# EAGLE design Combine2Cards (EAGLE 6.6.0)
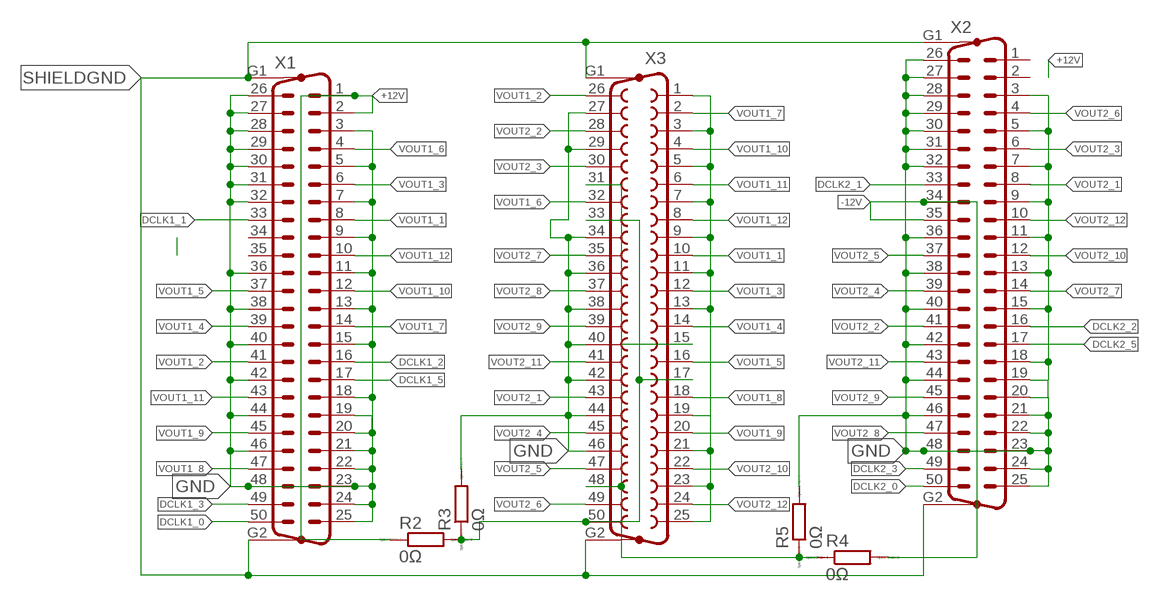
[diagram p0: schematic, sheet 1]

## Parts
R2  0Ω  RR0603  [R0603]
R3  0Ω  RR0603  [R0603]
R4  0Ω  RR0603  [R0603]
R5  0Ω  RR0603  [R0603]
X1  M50VP  [M50VP]
X2  M50VP  [M50VP]
X3  F50VP  [F50VP]

## Nets
+12V: R2.1 X1.1 X1.2
-12V: R4.2 X2.34 X2.35
DCLK1_0: X1.50
DCLK1_1: X1.33
DCLK1_2: X1.16
DCLK1_3: X1.49
DCLK1_5: X1.17
DCLK2_0: X2.50
DCLK2_1: X2.33
DCLK2_2: X2.16
DCLK2_3: X2.49
DCLK2_5: X2.17
GND: R3.2 R5.2 X1.3 X1.5 X1.7 X1.9 X1.11 X1.13 X1.15 X1.18 X1.19 X1.20 X1.21 X1.22 X1.23 X1.24 X1.25 X1.26 X1.27 X1.28 X1.29 X1.30 X1.31 X1.32 X1.36 X1.38 X1.40 X1.42 X1.44 X1.46 X1.48 X2.3 X2.5 X2.7 X2.9 X2.11 X2.13 X2.15 X2.18 X2.19 X2.20 X2.21 X2.22 X2.23 X2.24 X2.25 X2.26 X2.27 X2.28 X2.29 X2.30 X2.31 X2.32 X2.36 X2.38 X2.40 X2.42 X2.44 X2.46 X2.48 X3.1 X3.3 X3.5 X3.7 X3.9 X3.11 X3.13 X3.19 X3.21 X3.23 X3.25 X3.27 X3.29 X3.34 X3.36 X3.38 X3.40 X3.42 X3.44 X3.46
N$1: R2.2 R3.1 X3.17 X3.33 X3.50
N$2: R4.1 R5.1 X3.15 X3.31 X3.48
SHIELDGND: X1.G1 X1.G2 X2.G1 X2.G2 X3.G1 X3.G2
VOUT1_1: X1.8 X3.10
VOUT1_2: X1.41 X3.26
VOUT1_3: X1.6 X3.12
VOUT1_4: X1.39 X3.14
VOUT1_5: X1.37 X3.16
VOUT1_6: X1.4 X3.32
VOUT1_7: X1.14 X3.2
VOUT1_8: X1.47 X3.18
VOUT1_9: X1.45 X3.20
VOUT1_10: X1.12 X3.4
VOUT1_11: X1.43 X3.6
VOUT1_12: X1.10 X3.8
VOUT2_1: X2.8 X3.43
VOUT2_2: X2.41 X3.28
VOUT2_3: X2.6 X3.30
VOUT2_4: X2.39 X3.45
VOUT2_5: X2.37 X3.47
VOUT2_6: X2.4 X3.49
VOUT2_7: X2.14 X3.35
VOUT2_8: X2.47 X3.37
VOUT2_9: X2.45 X3.39
VOUT2_10: X2.12 X3.22
VOUT2_11: X2.43 X3.41
VOUT2_12: X2.10 X3.24
Unconnected: X1.34 X1.35 X2.1 X2.2

## Library data of the parts
R2-R5 = eagle-ltspice:R: RESISTOR, European symbol; SPICEMODEL: NONE; SPICEPREFIX: R
X1 X2 = con-subd:M50VP: SUB-D; OC_FARNELL: unknown; OC_NEWARK: unknown
X3 = con-subd:F50VP: SUB-D; OC_FARNELL: unknown; OC_NEWARK: unknown

## Board
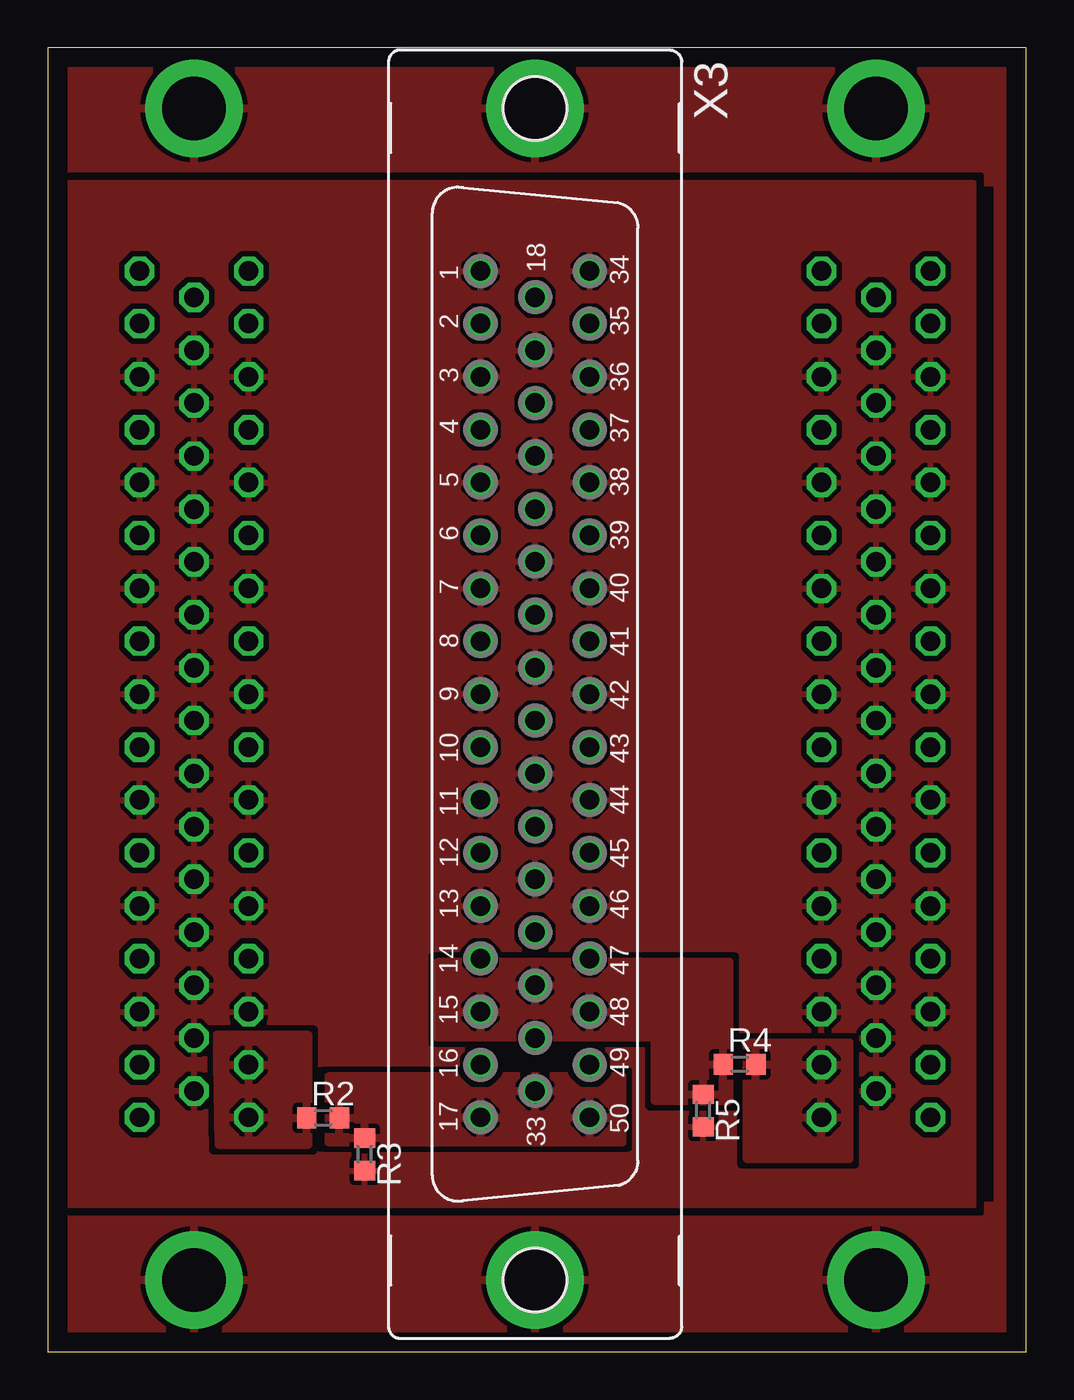
[diagram p1: board, top side]
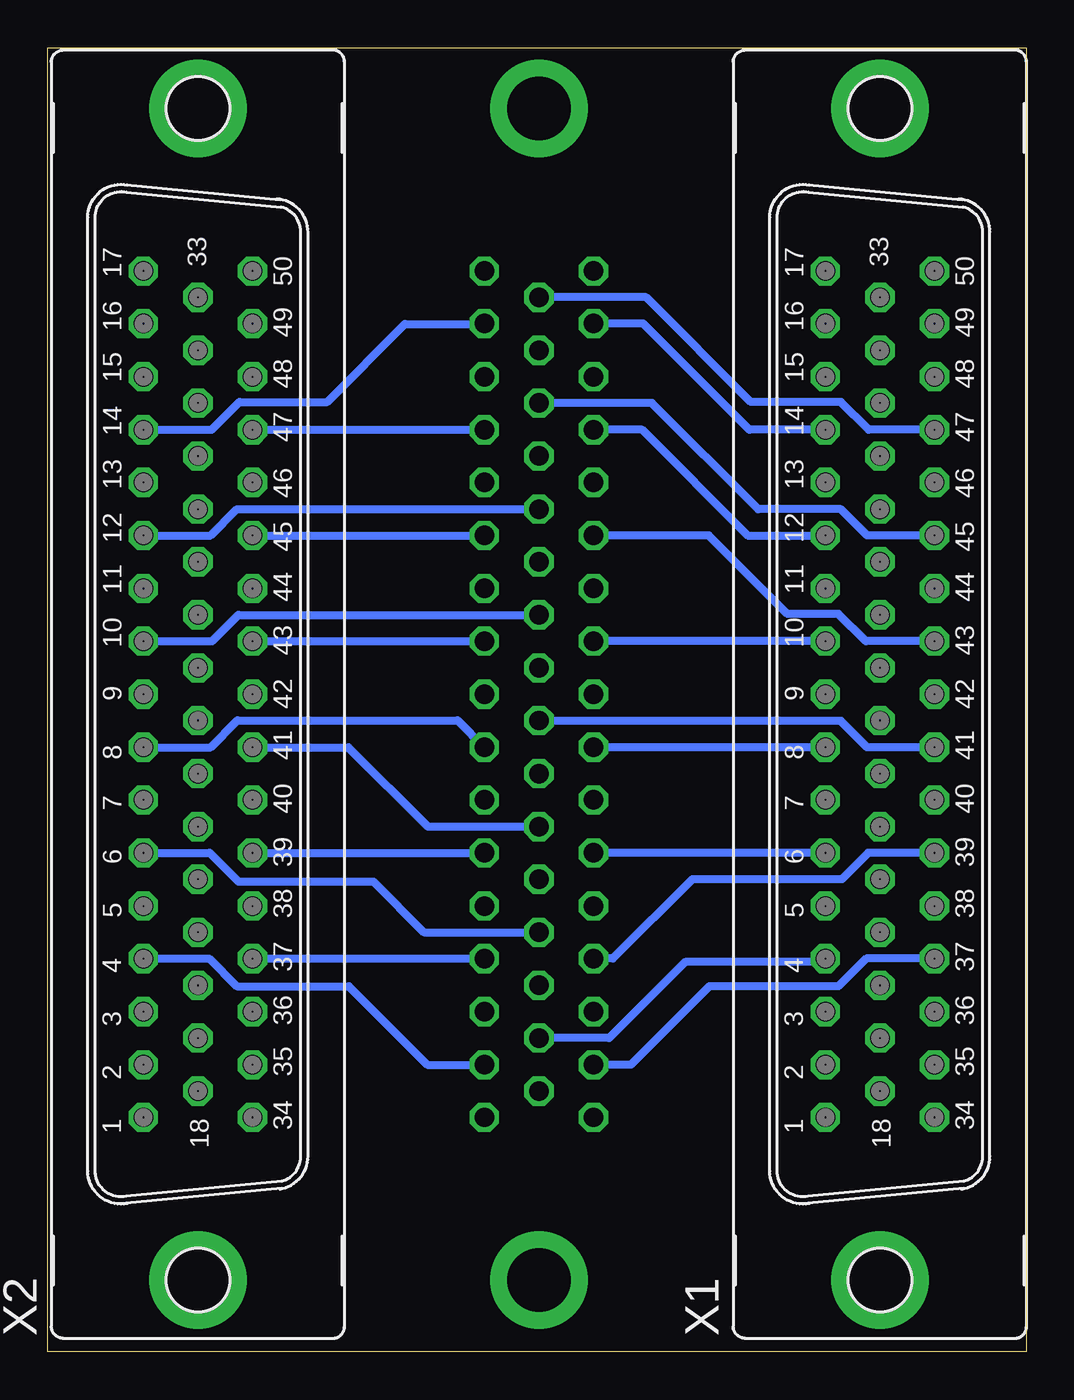
[diagram p2: board, bottom side, seen from below]

Size 51 x 68 mm. Coordinates in mm from the lower left corner, seen from the top.
Outline: 0,0 51,0 51,68 0,68 0,0
Copper layers (1*16): Top 0.035mm / dielectric 1.5mm / Bottom 0.035mm
Design rules "default": minimum track width 10mil, minimum drill 24mil, track to track 8mil, track to pad 8mil, pad to pad 8mil, via to via 8mil, smd to smd 8mil, copper to edge 40mil, drill to drill 8mil, minimum pad ring 10mil, minimum via ring 8mil, stop-mask expansion 4mil, vias tented up to drill 0mil, thermal gap 10mil

### Footprints (pad centres in the part's own frame; a part is rotated, then mirrored left to right if it is on the bottom)
R0603 = smd 1 x 1.1: 1 -0.85,0; 2 0.85,0
M50VP = drill 1.016 octagon: 1 -22.073,2.845; 2 -19.329,2.845; 3 -16.561,2.845; 4 -13.792,2.845; 5 -11.049,2.845; 6 -8.28,2.845; 7 -5.512,2.845; 8 -2.769,2.845; 9 0,2.845; 10 2.769,2.845; 11 5.512,2.845; 12 8.28,2.845; 13 11.049,2.845; 14 13.792,2.845; 15 16.561,2.845; 16 19.329,2.845; 17 22.073,2.845; 18 -20.701,0; 19 -17.932,0; 20 -15.189,0; 21 -12.421,0; 22 -9.652,0; 23 -6.909,0; 24 -4.14,0; 25 -1.372,0; 26 1.372,0; 27 4.14,0; 28 6.909,0; 29 9.652,0; 30 12.421,0; 31 15.189,0; 32 17.932,0; 33 20.701,0; 34 -22.073,-2.845; 35 -19.329,-2.845; 36 -16.561,-2.845; 37 -13.792,-2.845; 38 -11.049,-2.845; 39 -8.28,-2.845; 40 -5.512,-2.845; 41 -2.769,-2.845; 42 0,-2.845; 43 2.769,-2.845; 44 5.512,-2.845; 45 8.28,-2.845; 46 11.049,-2.845; 47 13.792,-2.845; 48 16.561,-2.845; 49 19.329,-2.845; 50 22.073,-2.845 | drill 3.302 pad 5.08: G1 -30.556,0; G2 30.556,0
F50VP = drill 1.016 octagon: 1 -22.073,-2.845; 2 -19.329,-2.845; 3 -16.561,-2.845; 4 -13.792,-2.845; 5 -11.049,-2.845; 6 -8.28,-2.845; 7 -5.512,-2.845; 8 -2.769,-2.845; 9 0,-2.845; 10 2.769,-2.845; 11 5.512,-2.845; 12 8.28,-2.845; 13 11.049,-2.845; 14 13.792,-2.845; 15 16.561,-2.845; 16 19.329,-2.845; 17 22.073,-2.845; 18 -20.701,0; 19 -17.932,0; 20 -15.189,0; 21 -12.421,0; 22 -9.652,0; 23 -6.909,0; 24 -4.14,0; 25 -1.372,0; 26 1.372,0; 27 4.14,0; 28 6.909,0; 29 9.652,0; 30 12.421,0; 31 15.189,0; 32 17.932,0; 33 20.701,0; 34 -22.073,2.845; 35 -19.329,2.845; 36 -16.561,2.845; 37 -13.792,2.845; 38 -11.049,2.845; 39 -8.28,2.845; 40 -5.512,2.845; 41 -2.769,2.845; 42 0,2.845; 43 2.769,2.845; 44 5.512,2.845; 45 8.28,2.845; 46 11.049,2.845; 47 13.792,2.845; 48 16.561,2.845; 49 19.329,2.845; 50 22.073,2.845 | drill 3.302 pad 5.08: G1 30.556,0; G2 -30.556,0

### Placement (x,y rotation side)
R2  14.35,12.19 0 top
R3  16.51,10.29 270 top
R4  36.07,14.99 0 top
R5  34.16,12.57 270 top
X1  7.62,34.29 90 bottom
X2  43.18,34.29 90 bottom
X3  25.4,34.29 270 top

### Tracks (layer width: path | path; a pad name or v marks a point on that pad's centre or on a via)
+12V
  pour Top: 13.59,16.51 8.76,16.51 8.89,10.79 13.59,10.79
-12V
  pour Top: 36.45,16.13 41.78,16.13 41.78,10.03 36.45,10.03
GND
  pour Top (isolate 0.305, rank 3): 0,60.96 48.26,60.96 48.26,7.62 0,7.62
N$1
  Top 0.406: 15.2,12.15 R2.2
  pour Top (isolate 0.406): 14.61,10.92 29.97,10.92 29.97,14.35 14.61,14.35
N$2
  pour Top: 20.32,20.32 20.32,16.38 31.62,16.38 31.62,13.08 35.56,13.08 35.56,20.32
SHIELDGND
  pour Top (isolate 0.406, rank 4): 0,67.31 50.8,67.31 50.8,0 0,0 0,7.62 49.53,7.62 49.53,60.96 0,60.96
VOUT1_1
  Bottom 0.406: X1.8 X3.10
VOUT1_2
  Bottom 0.406: X1.41 8.28,31.52 9.65,32.89 25.38,32.89 X3.26
VOUT1_3
  Bottom 0.406: X1.6 X3.12
VOUT1_4
  Bottom 0.406: X1.39 8.23,26.01 9.6,24.64 17.4,24.64 21.54,20.5 X3.14
VOUT1_5
  Bottom 0.406: X1.37 8.33,20.5 9.78,19.05 16.51,19.05 20.6,14.96 X3.16
VOUT1_6
  Bottom 0.406: X1.4 10.64,20.32 17.78,20.32 21.74,16.36 X3.32
VOUT1_7
  Bottom 0.406: X1.14 14.43,48.08 19.96,53.62 X3.2
VOUT1_8
  Bottom 0.406: X1.47 8.2,48.08 9.65,49.53 14.35,49.53 19.81,54.99 X3.18
VOUT1_9
  Bottom 0.406: X1.45 8.28,42.57 9.65,43.94 13.97,43.94 19.51,49.48 X3.20
VOUT1_10
  Bottom 0.406: X1.12 10.49,42.55 14.48,42.55 20.02,48.08 X3.4
VOUT1_11
  Bottom 0.406: X1.43 8.36,37.06 9.78,38.48 12.45,38.48 16.54,42.57 X3.6
VOUT1_12
  Bottom 0.406: X1.10 X3.8
VOUT2_1
  Bottom 0.406: X2.8 42.52,31.52 41.12,32.92 29.64,32.92 X3.43
VOUT2_2
  Bottom 0.406: X2.41 35.33,31.52 31.19,27.38 X3.28
VOUT2_3
  Bottom 0.406: X2.6 42.57,26.01 41.07,24.51 34.04,24.51 31.39,21.87 X3.30
VOUT2_4
  Bottom 0.406: X2.39 X3.45
VOUT2_5
  Bottom 0.406: X2.37 X3.47
VOUT2_6
  Bottom 0.406: X2.4 42.6,20.5 41.15,19.05 35.31,19.05 31.22,14.96 X3.49
VOUT2_7
  Bottom 0.406: X2.14 42.47,48.08 41.02,49.53 36.45,49.53 32.38,53.59 28.27,53.59 X3.35
VOUT2_8
  Bottom 0.406: X2.47 X3.37
VOUT2_9
  Bottom 0.406: X2.45 X3.39
VOUT2_10
  Bottom 0.406: X2.12 42.52,42.57 41.15,43.94 X3.22
VOUT2_11
  Bottom 0.406: X2.43 X3.41
VOUT2_12
  Bottom 0.406: X2.10 42.44,37.06 41.07,38.43 X3.24